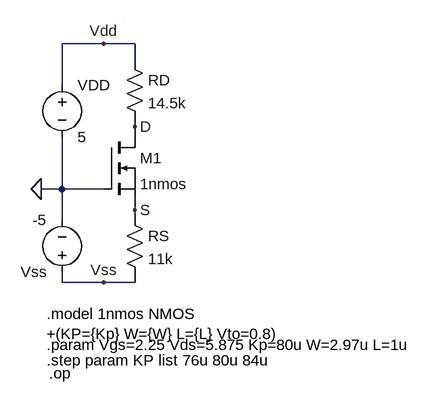
[diagram p0: schematic 15-3-8-a-1.asc]
15-3-8-a-1.asc, the LTspice schematic file:
Version 4
SHEET 1 880 680
WIRE 96 0 32 0
WIRE 144 0 96 0
WIRE 144 32 144 0
WIRE 32 64 32 0
WIRE 144 128 144 112
WIRE 144 144 144 128
WIRE 32 224 32 144
WIRE 32 224 0 224
WIRE 96 224 32 224
WIRE 144 256 144 240
WIRE 32 272 32 224
WIRE 144 272 144 256
WIRE 32 368 32 352
WIRE 96 368 32 368
WIRE 144 368 144 352
WIRE 144 368 96 368
FLAG 144 128 D
FLAG 144 256 S
FLAG 0 224 0
FLAG 96 0 Vdd
FLAG 96 368 Vss
SYMBOL res 128 16 R0
SYMATTR InstName RD
SYMATTR Value 14.5k
SYMBOL res 128 256 R0
SYMATTR InstName RS
SYMATTR Value 11k
SYMBOL nmos 96 144 R0
SYMATTR InstName M1
SYMATTR Value 1nmos
SYMBOL voltage 32 48 R0
WINDOW 123 0 0 Left 0
WINDOW 39 0 0 Left 0
SYMATTR InstName VDD
SYMATTR Value 5
SYMBOL voltage 32 368 R180
WINDOW 123 0 0 Left 0
WINDOW 39 0 0 Left 0
SYMATTR InstName Vss
SYMATTR Value -5
TEXT 8 416 Left 2 !.model 1nmos NMOS\n+(KP={Kp} W={W} L={L} Vto=0.8)
TEXT 8 464 Left 2 !.param Vgs=2.25 Vds=5.875 Kp=80u W=2.97u L=1u
TEXT 12 508 Left 2 !.op
TEXT 8 488 Left 2 !.step param KP list 76u 80u 84u

The netlist it stands for:
* 15-3-8-a-1.asc
RD Vdd D 14.5k
RS S Vss 11k
M1 D 0 S S 1nmos
VDD Vdd 0 5
Vss Vss 0 -5
.model NMOS NMOS
.model PMOS PMOS
.lib standard.mos
.model 1nmos NMOS
+(KP={Kp} W={W} L={L} Vto=0.8)
.param Vgs=2.25 Vds=5.875 Kp=80u W=2.97u L=1u
.op
.step param KP list 76u 80u 84u
.backanno
.end

* Results of the author's LTspice run, read from the files saved beside the schematic
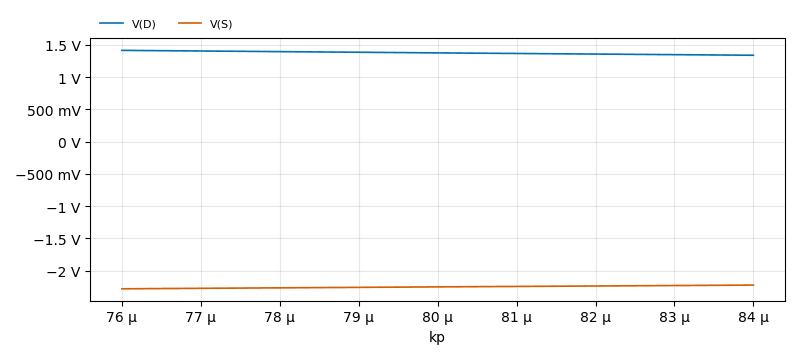
[diagram p1: Operating Point of 15-3-8-a-1.asc, plotted from the saved traces]
* Operating Point, 1 run:
*   V(D): 1.415 V at kp=76 µ, 1.339 V at kp=84 µ, min 1.339 V, max 1.415 V
*   V(S): -2.28 V at kp=76 µ, -2.223 V at kp=84 µ, min -2.28 V, max -2.223 V